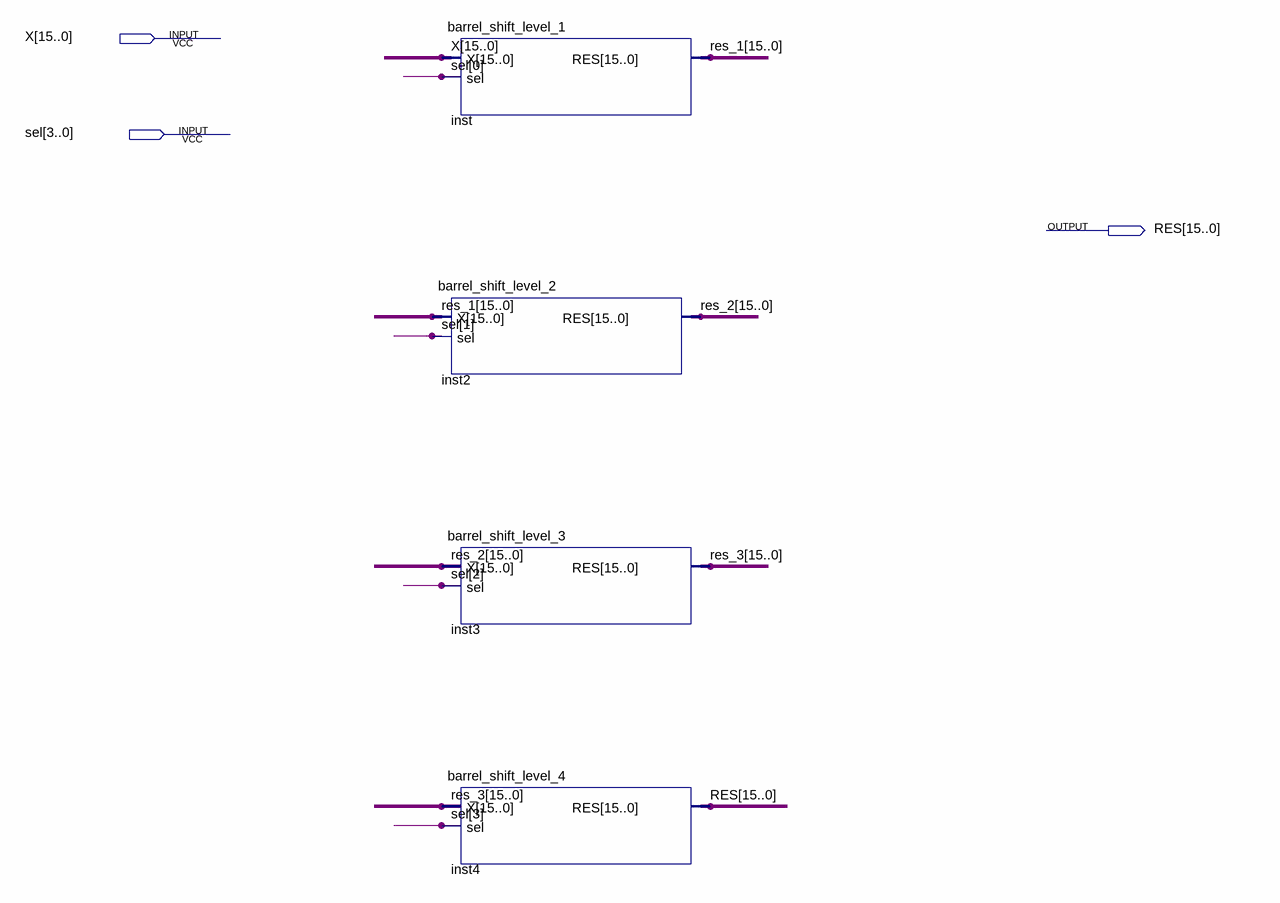
[diagram p0: schematic sheet]
// Quartus schematic shift_right.bdf as structural Verilog: 4 symbols, 3 pins
module shift_right (
  input  [15:0] X,
  input  [3:0] sel,
  output [15:0] RES
);

  wire [15:0] res_1, res_2, res_3;

  barrel_shift_level_1 inst (.X(X), .sel(sel[0]), .RES(res_1));
  barrel_shift_level_2 inst2 (.X(res_1), .sel(sel[1]), .RES(res_2));
  barrel_shift_level_3 inst3 (.X(res_2), .sel(sel[2]), .RES(res_3));
  barrel_shift_level_4 inst4 (.X(res_3), .sel(sel[3]), .RES(RES));
endmodule
